# EAGLE design arm-board-rev2 (EAGLE 6.5.0)

## Sheet 1 of 6: Processor
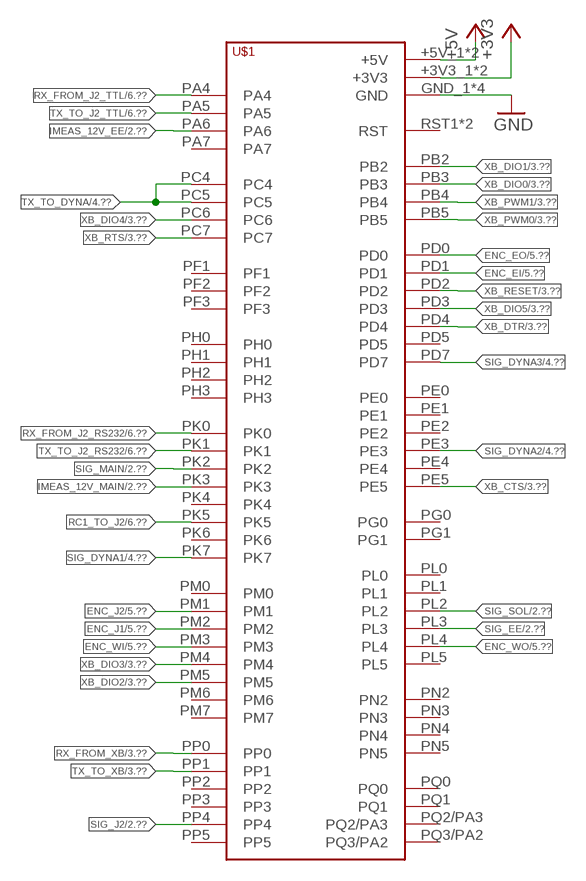
[diagram p0: schematic, sheet 1]

### Parts
U$1  TIVA-C-CONNECTED  [TIVA-C-CONNECTED]

### Nets
+3V3: U$1.+3V3_1(+3V3) U$1.+3V3_2(+3V3) ; also sheet 2,3,4,6
+5V: U$1.+5V_1(+5V) U$1.+5V_2(+5V) ; also sheet 2,5
ENC_EI: U$1.PD1 ; also sheet 5
ENC_EO: U$1.PD0 ; also sheet 5
ENC_J1: U$1.PM2 ; also sheet 5
ENC_J2: U$1.PM1 ; also sheet 5
ENC_WI: U$1.PM3 ; also sheet 5
ENC_WO: U$1.PL4 ; also sheet 5
GND: U$1.GND_1(GND) U$1.GND_2(GND) U$1.GND_3(GND) U$1.GND_4(GND) ; also sheet 2,3,4,5,6
IMEAS_12V_EE: U$1.PA6 ; also sheet 2
IMEAS_12V_MAIN: U$1.PK3 ; also sheet 2
RC1_TO_J2: U$1.PK5 ; also sheet 6
RX_FROM_J2_RS232: U$1.PK0 ; also sheet 6
RX_FROM_J2_TTL: U$1.PA4 ; also sheet 6
RX_FROM_XB: U$1.PP0 ; also sheet 3
SIG_DYNA1: U$1.PK7 ; also sheet 4
SIG_DYNA2: U$1.PE3 ; also sheet 4
SIG_DYNA3: U$1.PD7 ; also sheet 4
SIG_EE: U$1.PL3 ; also sheet 2
SIG_J2: U$1.PP4 ; also sheet 2
SIG_MAIN: U$1.PK2 ; also sheet 2
SIG_SOL: U$1.PL2 ; also sheet 2
TX_TO_DYNA: U$1.PC4 U$1.PC5 ; also sheet 4
TX_TO_J2_RS232: U$1.PK1 ; also sheet 6
TX_TO_J2_TTL: U$1.PA5 ; also sheet 6
TX_TO_XB: U$1.PP1 ; also sheet 3
XB_CTS: U$1.PE5 ; also sheet 3
XB_DIO0: U$1.PB3 ; also sheet 3
XB_DIO1: U$1.PB2 ; also sheet 3
XB_DIO2: U$1.PM5 ; also sheet 3
XB_DIO3: U$1.PM4 ; also sheet 3
XB_DIO4: U$1.PC6 ; also sheet 3
XB_DIO5: U$1.PD3 ; also sheet 3
XB_DTR: U$1.PD4 ; also sheet 3
XB_PWM0: U$1.PB5 ; also sheet 3
XB_PWM1: U$1.PB4 ; also sheet 3
XB_RESET: U$1.PD2 ; also sheet 3
XB_RTS: U$1.PC7 ; also sheet 3
Unconnected: U$1.PA7 U$1.PD5 U$1.PE0 U$1.PE1 U$1.PE2 U$1.PE4 U$1.PF1 U$1.PF2 U$1.PF3 U$1.PG0 U$1.PG1 U$1.PH0 U$1.PH1 U$1.PH2 U$1.PH3 U$1.PK4 U$1.PK6 U$1.PL0 U$1.PL1 U$1.PL5 U$1.PM0 U$1.PM6 U$1.PM7 U$1.PN2 U$1.PN3 U$1.PN4 U$1.PN5 U$1.PP2 U$1.PP3 U$1.PP5 U$1.PQ0 U$1.PQ1 U$1.PQ2/PA3 U$1.PQ3/PA2 U$1.RST1(RST) U$1.RST_2(RST)

## Sheet 2 of 6: Power
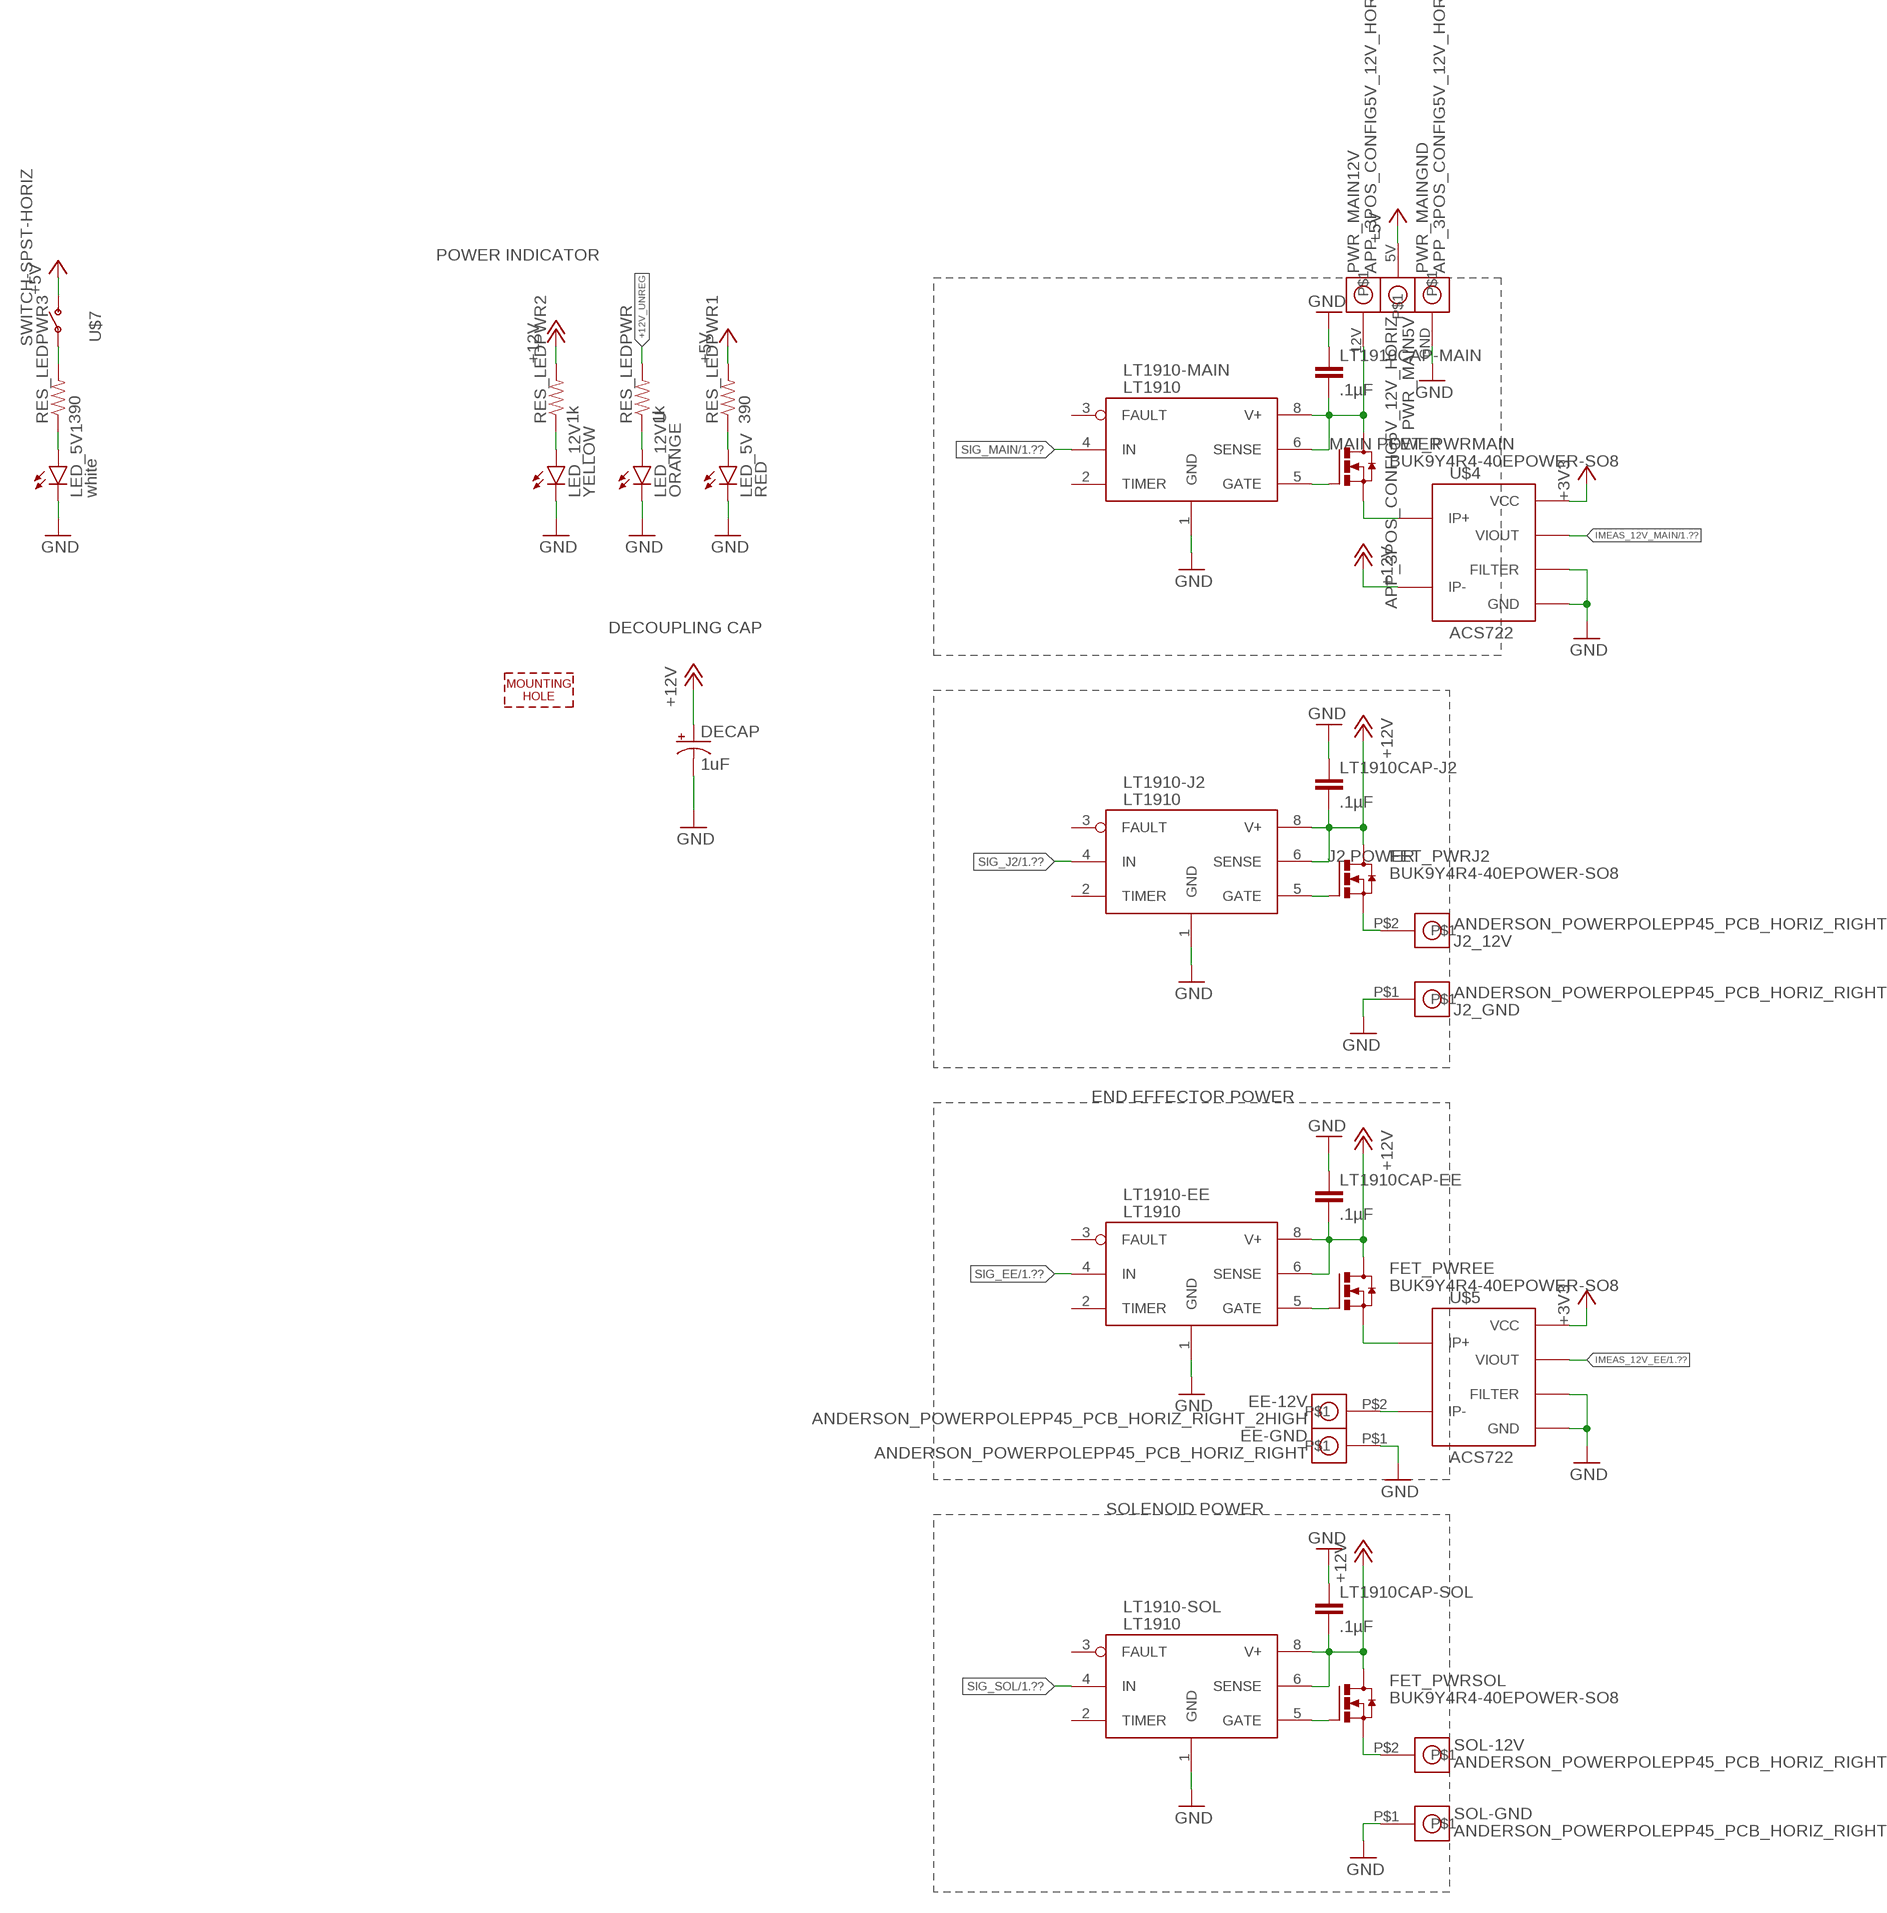
[diagram p1: schematic, sheet 2]

### Parts
DECAP  1uF  100UF-25V-20%(PTH)  [CPOL-RADIAL-100UF-25V]
EE-12V  ANDERSON_POWERPOLEPP45_PCB_HORIZ_RIGHT_2HIGH  [APP45_PCB_HORIZ_RIGHT_2HIGH]
EE-GND  ANDERSON_POWERPOLEPP45_PCB_HORIZ_RIGHT  [APP45_PCB_HORIZ_RIGHT]
FET_PWREE  BUK9Y4R4-40EPOWER-SO8  [POWER-SO8]
FET_PWRJ2  BUK9Y4R4-40EPOWER-SO8  [POWER-SO8]
FET_PWRMAIN  BUK9Y4R4-40EPOWER-SO8  [POWER-SO8]
FET_PWRSOL  BUK9Y4R4-40EPOWER-SO8  [POWER-SO8]
J2_12V  ANDERSON_POWERPOLEPP45_PCB_HORIZ_RIGHT_2HIGH  [APP45_PCB_HORIZ_RIGHT_2HIGH]
J2_GND  ANDERSON_POWERPOLEPP45_PCB_HORIZ_RIGHT  [APP45_PCB_HORIZ_RIGHT]
LED_5V  RED  LED0603  [LED-0603]
LED_5V1  white  LED1206  [LED-1206]
LED_12V  YELLOW  LED0603  [LED-0603]
LED_12VU  ORANGE  LED0603  [LED-0603]
LT1910-EE  LT1910  [SO8]
LT1910-J2  LT1910  [SO8]
LT1910-MAIN  LT1910  [SO8]
LT1910-SOL  LT1910  [SO8]
LT1910CAP-EE  .1µF  CAP0603-CAP  [0603-CAP]
LT1910CAP-J2  .1µF  CAP0603-CAP  [0603-CAP]
LT1910CAP-MAIN  .1µF  CAP0603-CAP  [0603-CAP]
LT1910CAP-SOL  .1µF  CAP0603-CAP  [0603-CAP]
PWR_MAIN  APP_3POS_CONFIG5V_12V_HORIZ  [APP45_5V_12V_HORIZ_CONFIG]
RES_LEDPWR  1k  RESISTOR0603  [0603-RES]
RES_LEDPWR1  390  RESISTOR0603  [0603-RES]
RES_LEDPWR2  1k  RESISTOR0603  [0603-RES]
RES_LEDPWR3  390  RESISTOR0603  [0603-RES]
SOL-12V  ANDERSON_POWERPOLEPP45_PCB_HORIZ_RIGHT_2HIGH  [APP45_PCB_HORIZ_RIGHT_2HIGH]
SOL-GND  ANDERSON_POWERPOLEPP45_PCB_HORIZ_RIGHT  [APP45_PCB_HORIZ_RIGHT]
U$3  MOUNTING_HOLE#6  [#6_SCREW]
U$4  ACS722  [SO-08]
U$5  ACS722  [SO-08]
U$7  SWITCH-SPST-HORIZ  [CW-GPTS203212BR2]

### Nets
+3V3: U$4.8(VCC) U$5.8(VCC) ; also sheet 1,3,4,6
+5V: PWR_MAIN.5V RES_LEDPWR1.2 U$7.P$2(S) ; also sheet 1,5
+12V: DECAP.1(+) FET_PWREE.5(D) FET_PWREE.6(D) FET_PWREE.7(D) FET_PWREE.8(D) FET_PWRJ2.5(D) FET_PWRJ2.6(D) FET_PWRJ2.7(D) FET_PWRJ2.8(D) FET_PWRSOL.5(D) FET_PWRSOL.6(D) FET_PWRSOL.7(D) FET_PWRSOL.8(D) LT1910-EE.6(SENSE) LT1910-EE.8(V+) LT1910-J2.6(SENSE) LT1910-J2.8(V+) LT1910-SOL.6(SENSE) LT1910-SOL.8(V+) LT1910CAP-EE.2 LT1910CAP-J2.2 LT1910CAP-SOL.2 RES_LEDPWR2.2 U$4.3(IP-) U$4.4(IP-) ; also sheet 4
+12V_UNREG: FET_PWRMAIN.5(D) FET_PWRMAIN.6(D) FET_PWRMAIN.7(D) FET_PWRMAIN.8(D) LT1910-MAIN.6(SENSE) LT1910-MAIN.8(V+) LT1910CAP-MAIN.2 PWR_MAIN.12V RES_LEDPWR.2
GATE-EE: FET_PWREE.4(G) LT1910-EE.5(GATE)
GATE-J2: FET_PWRJ2.4(G) LT1910-J2.5(GATE)
GATE-MAIN: FET_PWRMAIN.4(G) LT1910-MAIN.5(GATE)
GATE-SOL: FET_PWRSOL.4(G) LT1910-SOL.5(GATE)
GND: DECAP.2(-) EE-GND.P$1 J2_GND.P$1 LED_5V1.C LED_5V.C LED_12V.C LED_12VU.C LT1910-EE.1(GND) LT1910-J2.1(GND) LT1910-MAIN.1(GND) LT1910-SOL.1(GND) LT1910CAP-EE.1 LT1910CAP-J2.1 LT1910CAP-MAIN.1 LT1910CAP-SOL.1 PWR_MAIN.GND SOL-GND.P$1 U$4.5(GND) U$4.6(FILTER) U$5.5(GND) U$5.6(FILTER) ; also sheet 1,3,4,5,6
IMEAS_12V_EE: U$5.7(VIOUT) ; also sheet 1
IMEAS_12V_MAIN: U$4.7(VIOUT) ; also sheet 1
N$4: LED_12VU.A RES_LEDPWR.1
N$5: LED_5V.A RES_LEDPWR1.1
N$6: LED_12V.A RES_LEDPWR2.1
N$10: EE-12V.P$2 U$5.3(IP-) U$5.4(IP-)
N$11: LED_5V1.A RES_LEDPWR3.1
N$12: RES_LEDPWR3.2 U$7.P$1(P)
SIG_EE: LT1910-EE.4(IN) ; also sheet 1
SIG_J2: LT1910-J2.4(IN) ; also sheet 1
SIG_MAIN: LT1910-MAIN.4(IN) ; also sheet 1
SIG_SOL: LT1910-SOL.4(IN) ; also sheet 1
SOURCE-EE: FET_PWREE.1(S) FET_PWREE.2(S) FET_PWREE.3(S) U$5.1(IP+) U$5.2(IP+)
SOURCE-J2: FET_PWRJ2.1(S) FET_PWRJ2.2(S) FET_PWRJ2.3(S) J2_12V.P$2
SOURCE-MAIN: FET_PWRMAIN.1(S) FET_PWRMAIN.2(S) FET_PWRMAIN.3(S) U$4.1(IP+) U$4.2(IP+)
SOURCE-SOL: FET_PWRSOL.1(S) FET_PWRSOL.2(S) FET_PWRSOL.3(S) SOL-12V.P$2
Unconnected: LT1910-EE.2(TIMER) LT1910-EE.3(FAULT) LT1910-J2.2(TIMER) LT1910-J2.3(FAULT) LT1910-MAIN.2(TIMER) LT1910-MAIN.3(FAULT) LT1910-SOL.2(TIMER) LT1910-SOL.3(FAULT)

### Notes on the sheet
- POWER INDICATOR
- MAIN POWER
- DECOUPLING CAP
- J2 POWER
- END EFFECTOR POWER
- SOLENOID POWER

## Sheet 3 of 6: Xbee
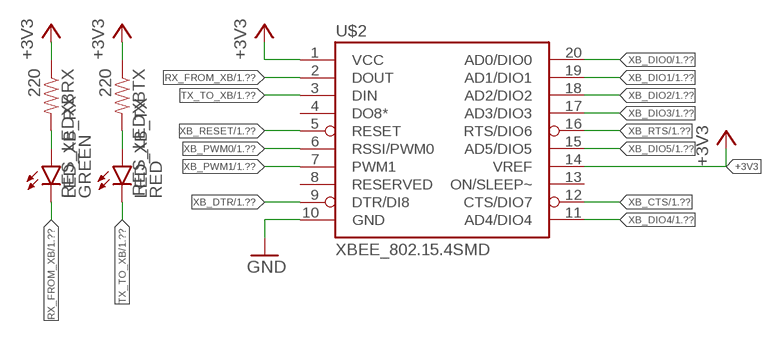
[diagram p2: schematic, sheet 3]

### Parts
LED_XB_RX  GREEN  LED0603  [LED-0603]
LED_XB_TX  RED  LED0603  [LED-0603]
RES_LEDXBRX  220  RESISTOR0603  [0603-RES]
RES_LEDXBTX  220  RESISTOR0603  [0603-RES]
U$2  XBEE_802.15.4SMD  [XBEE_802.15.4_SMD]

### Nets
+3V3: RES_LEDXBRX.1 RES_LEDXBTX.1 U$2.1(VCC) U$2.14(VREF) ; also sheet 1,2,4,6
GND: U$2.10(GND) ; also sheet 1,2,4,5,6
N$1: LED_XB_RX.A RES_LEDXBRX.2
N$2: LED_XB_TX.A RES_LEDXBTX.2
RX_FROM_XB: LED_XB_RX.C U$2.2(DOUT) ; also sheet 1
TX_TO_XB: LED_XB_TX.C U$2.3(DIN) ; also sheet 1
XB_CTS: U$2.12(CTS/DIO7) ; also sheet 1
XB_DIO0: U$2.20(AD0/DIO0) ; also sheet 1
XB_DIO1: U$2.19(AD1/DIO1) ; also sheet 1
XB_DIO2: U$2.18(AD2/DIO2) ; also sheet 1
XB_DIO3: U$2.17(AD3/DIO3) ; also sheet 1
XB_DIO4: U$2.11(AD4/DIO4) ; also sheet 1
XB_DIO5: U$2.15(AD5/DIO5) ; also sheet 1
XB_DTR: U$2.9(DTR/DI8) ; also sheet 1
XB_PWM0: U$2.6(RSSI/PWM0) ; also sheet 1
XB_PWM1: U$2.7(PWM1) ; also sheet 1
XB_RESET: U$2.5(RESET) ; also sheet 1
XB_RTS: U$2.16(RTS/DIO6) ; also sheet 1
Unconnected: U$2.4(DO8*) U$2.8(RESERVED) U$2.13(ON/SLEEP~)

## Sheet 4 of 6: Dynamixels
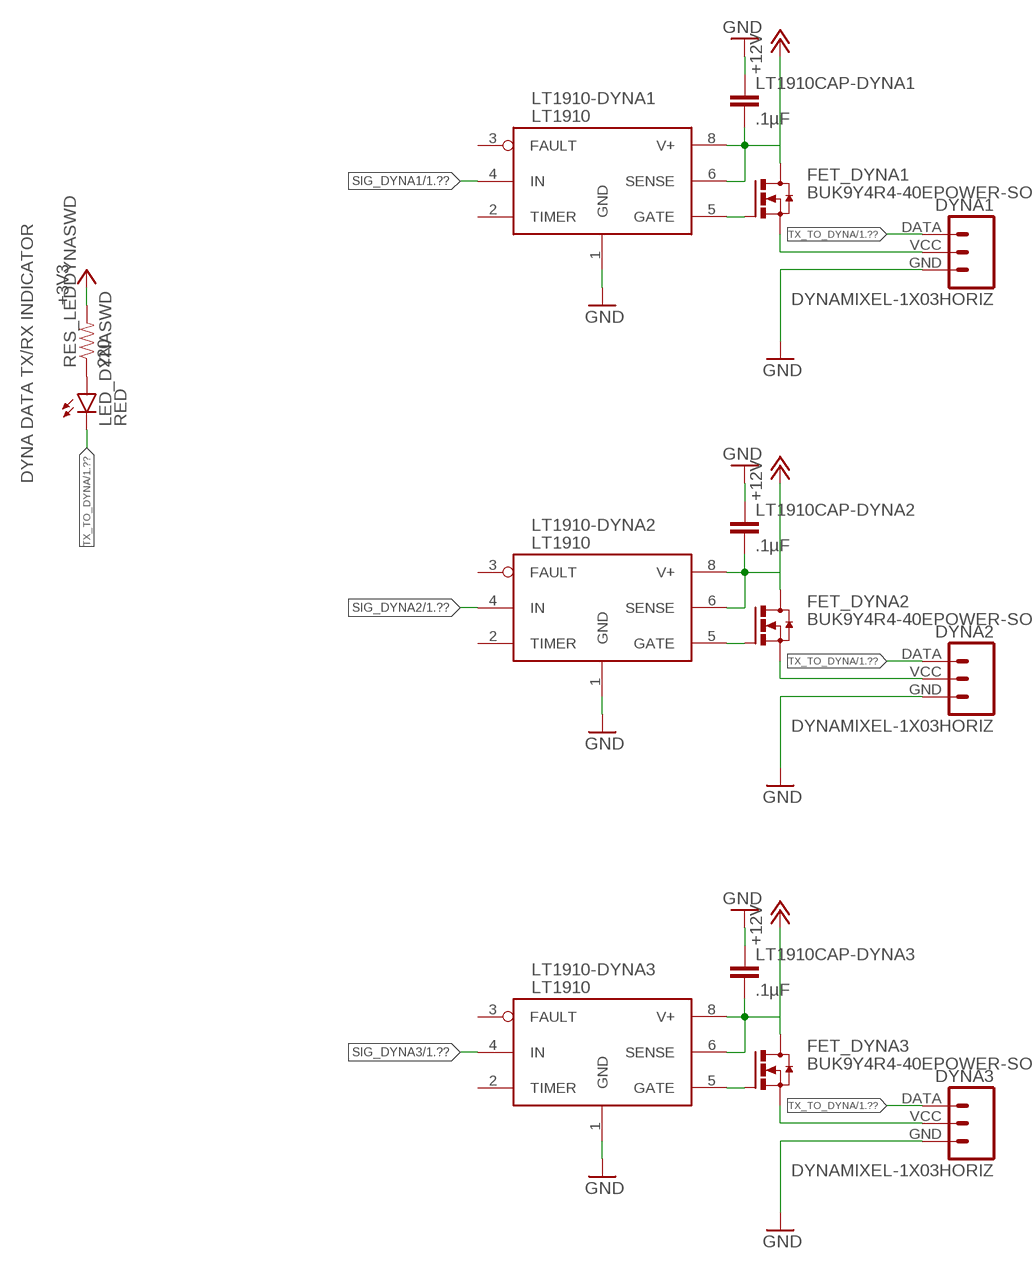
[diagram p3: schematic, sheet 4]

### Parts
DYNA1  DYNAMIXEL-1X03HORIZ  [MLX-SPOX5268-3PIN]
DYNA2  DYNAMIXEL-1X03HORIZ  [MLX-SPOX5268-3PIN]
DYNA3  DYNAMIXEL-1X03HORIZ  [MLX-SPOX5268-3PIN]
FET_DYNA1  BUK9Y4R4-40EPOWER-SO8  [POWER-SO8]
FET_DYNA2  BUK9Y4R4-40EPOWER-SO8  [POWER-SO8]
FET_DYNA3  BUK9Y4R4-40EPOWER-SO8  [POWER-SO8]
LED_DYNASWD  RED  LED0603  [LED-0603]
LT1910-DYNA1  LT1910  [SO8]
LT1910-DYNA2  LT1910  [SO8]
LT1910-DYNA3  LT1910  [SO8]
LT1910CAP-DYNA1  .1µF  CAP0603-CAP  [0603-CAP]
LT1910CAP-DYNA2  .1µF  CAP0603-CAP  [0603-CAP]
LT1910CAP-DYNA3  .1µF  CAP0603-CAP  [0603-CAP]
RES_LEDDYNASWD  220  RESISTOR0603  [0603-RES]

### Nets
+3V3: RES_LEDDYNASWD.2 ; also sheet 1,2,3,6
+12V: FET_DYNA1.5(D) FET_DYNA1.6(D) FET_DYNA1.7(D) FET_DYNA1.8(D) FET_DYNA2.5(D) FET_DYNA2.6(D) FET_DYNA2.7(D) FET_DYNA2.8(D) FET_DYNA3.5(D) FET_DYNA3.6(D) FET_DYNA3.7(D) FET_DYNA3.8(D) LT1910-DYNA1.6(SENSE) LT1910-DYNA1.8(V+) LT1910-DYNA2.6(SENSE) LT1910-DYNA2.8(V+) LT1910-DYNA3.6(SENSE) LT1910-DYNA3.8(V+) LT1910CAP-DYNA1.2 LT1910CAP-DYNA2.2 LT1910CAP-DYNA3.2 ; also sheet 2
GATE-DYNA1: FET_DYNA1.4(G) LT1910-DYNA1.5(GATE)
GATE-DYNA2: FET_DYNA2.4(G) LT1910-DYNA2.5(GATE)
GATE-DYNA3: FET_DYNA3.4(G) LT1910-DYNA3.5(GATE)
GND: DYNA1.GND DYNA2.GND DYNA3.GND LT1910-DYNA1.1(GND) LT1910-DYNA2.1(GND) LT1910-DYNA3.1(GND) LT1910CAP-DYNA1.1 LT1910CAP-DYNA2.1 LT1910CAP-DYNA3.1 ; also sheet 1,2,3,5,6
N$3: LED_DYNASWD.A RES_LEDDYNASWD.1
SIG_DYNA1: LT1910-DYNA1.4(IN) ; also sheet 1
SIG_DYNA2: LT1910-DYNA2.4(IN) ; also sheet 1
SIG_DYNA3: LT1910-DYNA3.4(IN) ; also sheet 1
SOURCE-DYNA1: DYNA1.VCC FET_DYNA1.1(S) FET_DYNA1.2(S) FET_DYNA1.3(S)
SOURCE-DYNA2: DYNA2.VCC FET_DYNA2.1(S) FET_DYNA2.2(S) FET_DYNA2.3(S)
SOURCE-DYNA3: DYNA3.VCC FET_DYNA3.1(S) FET_DYNA3.2(S) FET_DYNA3.3(S)
TX_TO_DYNA: DYNA1.DATA DYNA2.DATA DYNA3.DATA LED_DYNASWD.C ; also sheet 1
Unconnected: LT1910-DYNA1.2(TIMER) LT1910-DYNA1.3(FAULT) LT1910-DYNA2.2(TIMER) LT1910-DYNA2.3(FAULT) LT1910-DYNA3.2(TIMER) LT1910-DYNA3.3(FAULT)

### Notes on the sheet
- DYNA DATA TX/RX INDICATOR

## Sheet 5 of 6: Encoders
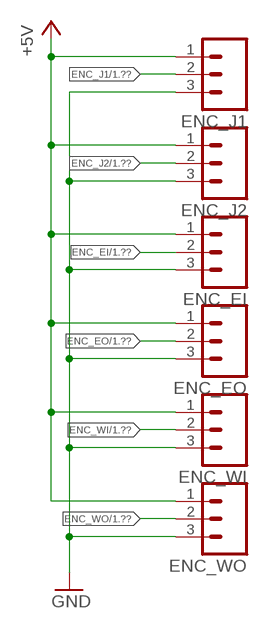
[diagram p4: schematic, sheet 5]

### Parts
ENC_EI  M03  [MOLEX_0436500300]
ENC_EO  M03  [MOLEX_0436500300]
ENC_J1  M03  [MOLEX_0436500300]
ENC_J2  M03  [MOLEX_0436500300]
ENC_WI  M03  [MOLEX_0436500300]
ENC_WO  M03  [MOLEX_0436500300]

### Nets
+5V: ENC_EI.1 ENC_EO.1 ENC_J1.1 ENC_J2.1 ENC_WI.1 ENC_WO.1 ; also sheet 1,2
ENC_EI: ENC_EI.2 ; also sheet 1
ENC_EO: ENC_EO.2 ; also sheet 1
ENC_J1: ENC_J1.2 ; also sheet 1
ENC_J2: ENC_J2.2 ; also sheet 1
ENC_WI: ENC_WI.2 ; also sheet 1
ENC_WO: ENC_WO.2 ; also sheet 1
GND: ENC_EI.3 ENC_EO.3 ENC_J1.3 ENC_J2.3 ENC_WI.3 ENC_WO.3 ; also sheet 1,2,3,4,6

## Sheet 6 of 6: J2
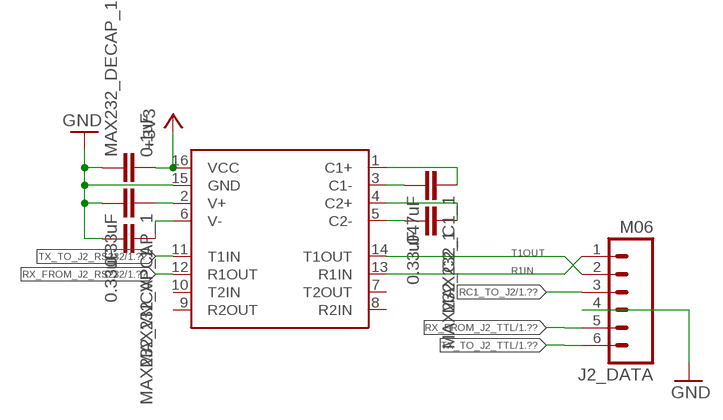
[diagram p5: schematic, sheet 6]

### Parts
J2_DATA  M06  [MOLEX_0436500600]
MAX232_1  MAX3232SO16  [SO16]
MAX232_C1_1  .047uF  CAP0603-CAP  [0603-CAP]
MAX232_C2_1  0.33uF  CAP0603-CAP  [0603-CAP]
MAX232_DECAP_1  0.1uF  CAP0603-CAP  [0603-CAP]
MAX232_VNCAP_1  0.33uF  CAP0603-CAP  [0603-CAP]
MAX232_VPCAP_1  0.33uF  CAP0603-CAP  [0603-CAP]

### Nets
+3V3: MAX232_1.16(VCC) MAX232_DECAP_1.2 ; also sheet 1,2,3,4
GND: J2_DATA.4 MAX232_1.15(GND) MAX232_DECAP_1.1 MAX232_VNCAP_1.2 MAX232_VPCAP_1.2 ; also sheet 1,2,3,4,5
N$1_1: MAX232_1.1(C1+) MAX232_C1_1.1
N$2_1: MAX232_1.2(V+) MAX232_VPCAP_1.1
N$3_1: MAX232_1.3(C1-) MAX232_C1_1.2
N$4_1: MAX232_1.4(C2+) MAX232_C2_1.1
N$5_1: MAX232_1.5(C2-) MAX232_C2_1.2
N$6_1: MAX232_1.6(V-) MAX232_VNCAP_1.1
R1IN: J2_DATA.1 MAX232_1.13(R1IN)
RC1_TO_J2: J2_DATA.3 ; also sheet 1
RX_FROM_J2_RS232: MAX232_1.12(R1OUT) ; also sheet 1
RX_FROM_J2_TTL: J2_DATA.5 ; also sheet 1
T1OUT: J2_DATA.2 MAX232_1.14(T1OUT)
TX_TO_J2_RS232: MAX232_1.11(T1IN) ; also sheet 1
TX_TO_J2_TTL: J2_DATA.6 ; also sheet 1
Unconnected: MAX232_1.7(T2OUT) MAX232_1.8(R2IN) MAX232_1.9(R2OUT) MAX232_1.10(T2IN)

## Library data of the parts
DECAP = SparkFun-Capacitors:100UF-25V-20%(PTH): CAP-08439; PROD_ID: CAP-08439
DYNA1-DYNA3 = MRDT-2015-Arm:DYNAMIXEL-1X03; MFR: Molex; MFR_PN: 0022057035; ORIENT: Horiz
EE-12V EE-GND J2_12V J2_GND SOL-12V SOL-GND = MRDT-Connectors:ANDERSON_POWERPOLE: http://www.powerwerx.com/anderson-powerpoles/
ENC_EI ENC_EO ENC_J1 ENC_J2 ENC_WI ENC_WO = MRDT-Connectors:M03
FET_DYNA1-FET_DYNA3 FET_PWREE FET_PWRJ2 FET_PWRMAIN FET_PWRSOL = MRDT-2015-General:BUK9Y4R4-40E; MFR: NXP; MFR_PN: BUK9Y4R4-40E; PACKAGE: POWER-SO8
J2_DATA = MRDT-Connectors:M06
LED_5V LED_5V1 LED_12V LED_12VU LED_DYNASWD LED_XB_RX LED_XB_TX = SparkFun-LED:LED: LEDs Standard schematic elements and footprints for 5mm, 3mm, 1206, and 0603 sized LEDs. 5mm - Spark Fun Electronics SKU : COM-00529 (and others)
LT1910-DYNA1-LT1910-DYNA3 LT1910-EE LT1910-J2 LT1910-MAIN LT1910-SOL = Jake:LT1910
LT1910CAP-DYNA1-LT1910CAP-DYNA3 LT1910CAP-EE LT1910CAP-J2 LT1910CAP-MAIN LT1910CAP-SOL MAX232_C1_1 MAX232_C2_1 MAX232_DECAP_1 MAX232_VNCAP_1 MAX232_VPCAP_1 = SparkFun-Capacitors:CAP: Capacitor Standard 0603 ceramic capacitor, and 0.1" leaded capacitor.
MAX232_1 = MRDT-Digital-ICs:MAX3232: MAX3232 RS232 Transceiver http://pdfserv.maximintegrated.com/en/ds/MAX3222-MAX3241.pdf
PWR_MAIN = MRDT-Connectors:APP_3POS_CONFIG; COLOR1: YELLOW; COLOR2: RED; COLOR3: BLACK
RES_LEDDYNASWD RES_LEDPWR RES_LEDPWR1-RES_LEDPWR3 RES_LEDXBRX RES_LEDXBTX = SparkFun-Resistors:RESISTOR: Resistor Basic schematic elements and footprints for 0603, 1206, and PTH resistors.
U$1 = MRDT-2015-General:TIVA-C-CONNECTED: TIVA C CONNECTED LAUNCHPAD
U$2 = MRDT-RF:XBEE_802.15.4
U$3 = MRDT-Hardware:MOUNTING_HOLE: Mounting hole for M6 bolt. Standard use mounting hole for: Tiva C Connected - M6 Anderson Powerpole Mounting Wing - M8 Most frame-mounted PCB's - M8
U$4 U$5 = MRDT-PowerICs:ACS722
U$7 = MRDT-Electromechanical:SWITCH-SPST-HORIZ

## Board
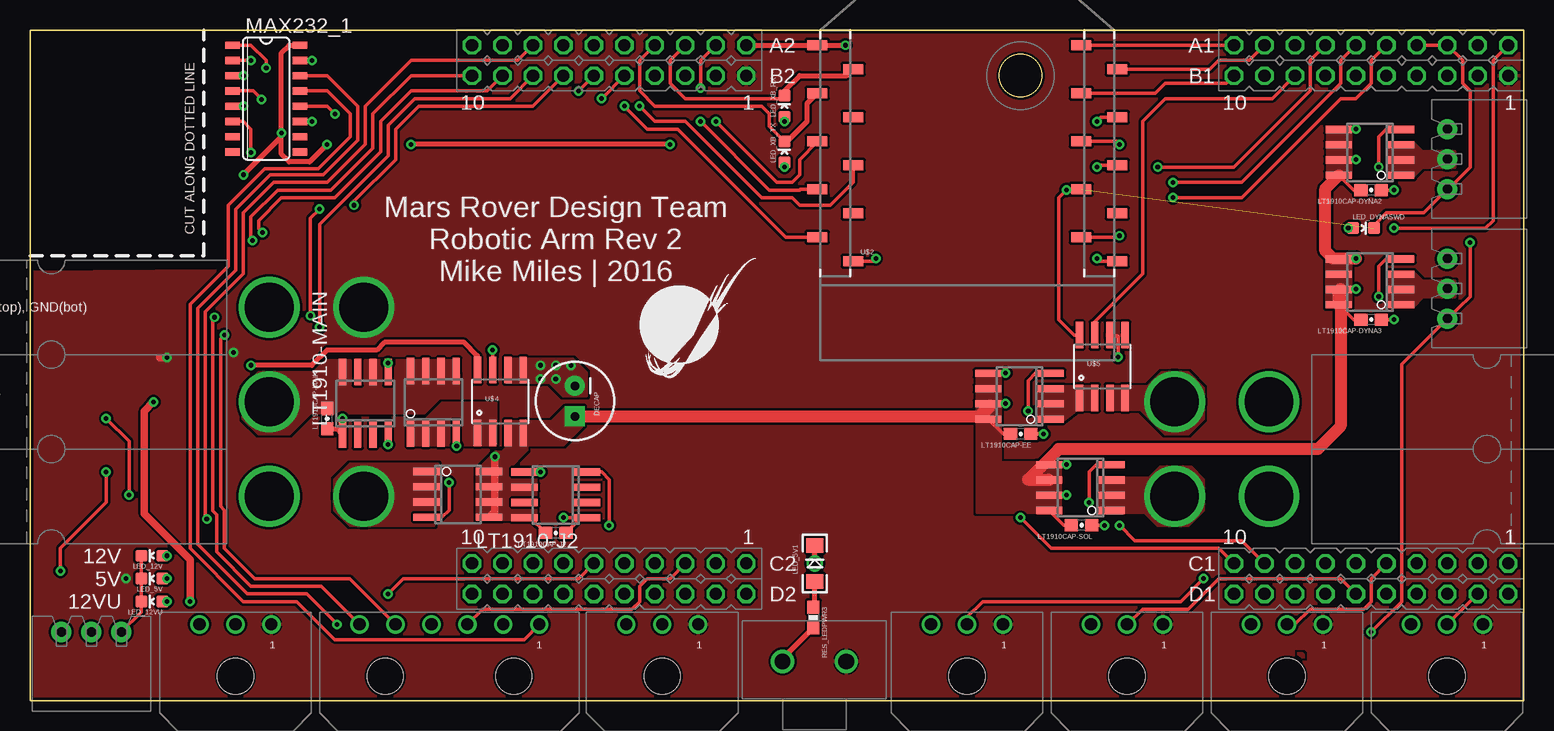
[diagram p6: board, top side]
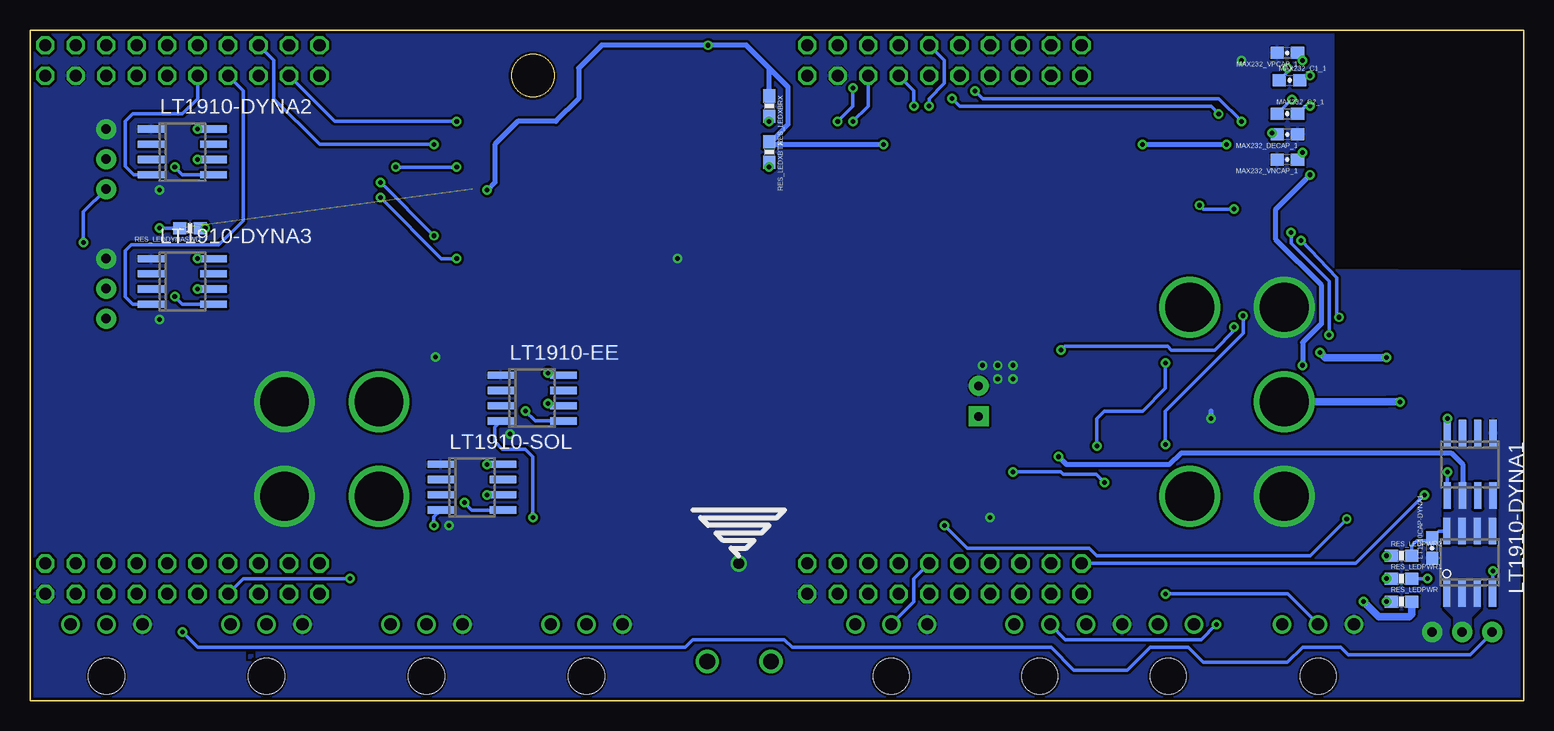
[diagram p7: board, bottom side, seen from below]

Size 124.46 x 55.88 mm. Coordinates in mm from the lower left corner, seen from the top.
Outline: 124.46,55.88 124.46,0 0,0 0,55.88 124.46,55.88
Copper layers (1*16): Top 0.035mm / dielectric 1.5mm / Bottom 0.035mm
Design rules "default *": minimum track width 10mil, minimum drill 15mil, track to track 8mil, track to pad 8mil, pad to pad 8mil, via to via 8mil, smd to smd 8mil, copper to edge 8mil, drill to drill 8mil, minimum pad ring 10mil, minimum via ring 8mil, stop-mask expansion 4mil, vias tented up to drill 0mil, thermal gap 5mil
tKeepout: area 0,35.9 to 15.6,56
bKeepout: area 0,35.9 to 15.6,56
tRestrict: area 0,35.9 to 15.6,56
bRestrict: area 0,35.9 to 15.6,56
vRestrict: area 0,35.9 to 15.6,56

### Footprints (pad centres in the part's own frame; a part is rotated, then mirrored left to right if it is on the bottom)
CPOL-RADIAL-100UF-25V = drill 0.7 pad 1.651 square: 1 1.27,0 | drill 0.7 pad 1.651: 2 -1.27,0
MLX-SPOX5268-3PIN = drill 0.8 pad 1.676: DATA 5,0; GND 0,0; VCC 2.5,0
APP45_PCB_HORIZ_RIGHT_2HIGH = drill 4.064: P$2 36.068,3.937
APP45_PCB_HORIZ_RIGHT = drill 4.064: P$1 28.194,3.937
MOLEX_0436500300 = drill 1.016: 1 9.322,8.89; 2 6.325,8.89; 3 3.327,8.89 | hole 2.997: 6.325,4.572
POWER-SO8 = smd 0.6 x 2.2: 1 0.595,-0.6; 2 1.865,-0.6; 3 3.135,-0.6; 4 4.405,-0.6; 5 4.405,4.6; 6 3.135,4.6; 7 1.865,4.6; 8 0.595,4.6
MOLEX_0436500600 = drill 1.016: 1 18.313,8.89; 2 15.316,8.89; 3 12.319,8.89; 4 9.322,8.89; 5 6.325,8.89; 6 3.327,8.89 | hole 2.997: 5.486,4.572; 16.18,4.572
LED-0603 = smd 1 x 1: A 0,-0.877; C 0,0.877
LED-1206 = smd 1.2 x 1.4: A -1.5,0; C 1.5,0
SO8 = smd 0.6 x 2.2: 1 -1.905,-2.6; 2 -0.635,-2.6; 3 0.635,-2.6; 4 1.905,-2.6; 5 1.905,2.6; 6 0.635,2.6; 7 -0.635,2.6; 8 -1.905,2.6
0603-CAP = smd 1.1 x 1: 1 -0.85,0; 2 0.85,0
SO16 = smd 0.6 x 1.2: 1 -4.445,-2.8; 2 -3.175,-2.8; 3 -1.905,-2.8; 4 -0.635,-2.8; 5 0.635,-2.8; 6 1.905,-2.8; 7 3.175,-2.8; 8 4.445,-2.8; 9 4.445,2.8; 10 3.175,2.8; 11 1.905,2.8; 12 0.635,2.8; 13 -0.635,2.8; 14 -1.905,2.8; 15 -3.175,2.8; 16 -4.445,2.8
APP45_5V_12V_HORIZ_CONFIG = drill 4.064: 5V 36.068,11.811; 12V 28.194,3.937; GND 28.194,11.811
0603-RES = smd 1.1 x 1: 1 -0.85,0; 2 0.85,0
TIVA-C-CONNECTED = drill 1.016 octagon: +3V3_1 59.69,54.61; +3V3_2 123.19,54.61; +5V_1 59.69,52.07; +5V_2 123.19,52.07; GND_1 57.15,52.07; GND_2 59.69,8.89; GND_3 120.65,52.07; GND_4 123.19,8.89; PA4 39.37,52.07; PA5 36.83,52.07; PA6 105.41,52.07; PA7 52.07,8.89; PB2 102.87,54.61; PB3 100.33,54.61; PB4 54.61,52.07; PB5 52.07,52.07; PC4 118.11,54.61; PC5 115.57,54.61; PC6 113.03,54.61; PC7 105.41,54.61; PD0 107.95,8.89; PD1 110.49,8.89; PD2 57.15,54.61; PD3 107.95,54.61; PD4 49.53,54.61; PD5 46.99,54.61; PD7 107.95,52.07; PE0 118.11,52.07; PE1 115.57,52.07; PE2 113.03,52.07; PE3 110.49,52.07; PE4 120.65,54.61; PE5 110.49,54.61; PF1 123.19,11.43; PF2 120.65,11.43; PF3 118.11,11.43; PG0 115.57,11.43; PG1 59.69,11.43; PH0 44.45,11.43; PH1 41.91,11.43; PH2 118.11,8.89; PH3 115.57,8.89; PK0 49.53,52.07; PK1 46.99,52.07; PK2 44.45,52.07; PK3 41.91,52.07; PK4 57.15,11.43; PK5 54.61,11.43; PK6 39.37,11.43; PK7 36.83,11.43; PL0 107.95,11.43; PL1 105.41,11.43; PL2 102.87,11.43; PL3 100.33,11.43; PL4 113.03,11.43; PL5 110.49,11.43; PM0 52.07,11.43; PM1 49.53,11.43; PM2 46.99,11.43; PM3 120.65,8.89; PM4 102.87,52.07; PM5 100.33,52.07; PM6 36.83,8.89; PM7 57.15,8.89; PN2 105.41,8.89; PN3 102.87,8.89; PN4 36.83,54.61; PN5 39.37,54.61; PP0 54.61,54.61; PP1 52.07,54.61; PP2 100.33,8.89; PP3 41.91,8.89; PP4 41.91,54.61; PP5 54.61,8.89; PQ0 44.45,54.61; PQ1 39.37,8.89; PQ2/PA3 46.99,8.89; PQ3/PA2 44.45,8.89; RST1 49.53,8.89; RST_2 113.03,8.89
XBEE_802.15.4_SMD = smd 1.7 x 0.85: 1 -13.77,20; 2 -10.77,18; 3 -13.77,16; 4 -10.77,14; 5 -13.77,12; 6 -10.77,10; 7 -13.77,8; 8 -10.77,6; 9 -13.77,4; 10 -10.77,2; 11 11.23,2; 12 8.23,4; 13 11.23,6; 14 8.23,8; 15 11.23,10; 16 8.23,12; 17 11.23,14; 18 8.23,16; 19 11.23,18; 20 8.23,20
SO-08 = smd 0.61 x 2.21: 1 0.457,-0.813; 2 1.727,-0.813; 3 2.997,-0.813; 4 4.267,-0.813; 5 4.267,4.419; 6 2.997,4.419; 7 1.727,4.419; 8 0.457,4.419
CW-GPTS203212BR2 = drill 1.3: P$1 3.4,3.35; P$2 3.4,8.65

### Placement (x,y rotation side)
DECAP  45.4,24.96 270 top
DYNA1  7.62,5.71 180 top
DYNA2  118.11,47.62 270 top
DYNA3  118.11,36.83 270 top
EE-12V  131.44,28.83 180 top
EE-GND  131.44,28.83 180 top
ENC_EI  85.09,-2.54 0 top
ENC_EO  71.75,-2.54 0 top
ENC_J1  10.79,-2.54 0 top
ENC_J2  46.35,-2.54 0 top
ENC_WI  111.76,-2.54 0 top
ENC_WO  98.42,-2.54 0 top
FET_DYNA1  6.99,9.53 0 bottom
FET_DYNA2  113.67,43.18 90 top
FET_DYNA3  113.67,32.38 90 top
FET_PWREE  84.45,22.86 90 top
FET_PWRJ2  33.66,19.69 270 top
FET_PWRMAIN  31.11,22.86 0 top
FET_PWRSOL  89.53,15.24 90 top
J2_12V  -8.26,13.08 0 top
J2_DATA  24.13,-2.54 0 top
J2_GND  -8.26,13.08 0 top
LED_5V  10.16,10.16 90 top
LED_5V1  65.41,11.43 90 top
LED_12V  10.16,12.07 90 top
LED_12VU  10.16,8.25 90 top
LED_DYNASWD  111.12,39.37 270 top
LED_XB_RX  62.87,49.53 0 top
LED_XB_TX  62.87,45.72 0 top
LT1910-DYNA1  4.45,19.69 180 bottom
LT1910-DYNA2  111.76,45.72 270 bottom
LT1910-DYNA3  111.76,34.92 270 bottom
LT1910-EE  82.61,25.21 270 bottom
LT1910-J2  43.81,17.14 90 top
LT1910-MAIN  27.94,24.77 0 top
LT1910-SOL  87.63,17.78 270 bottom
LT1910CAP-DYNA1  7.62,12.7 90 bottom
LT1910CAP-DYNA2  111.76,42.55 180 top
LT1910CAP-DYNA3  111.76,31.75 180 top
LT1910CAP-EE  82.55,22.23 180 top
LT1910CAP-J2  43.81,13.97 180 top
LT1910CAP-MAIN  24.77,23.49 90 top
LT1910CAP-SOL  87.63,14.61 180 top
MAX232_1  19.68,50.16 270 top
MAX232_C1_1  19.49,51.69 0 bottom
MAX232_C2_1  19.68,48.89 0 bottom
MAX232_DECAP_1  19.68,47.18 180 bottom
MAX232_VNCAP_1  19.68,45.09 180 bottom
MAX232_VPCAP_1  19.68,53.98 180 bottom
PWR_MAIN  -8.26,20.95 0 top
RES_LEDDYNASWD  111.12,39.37 180 bottom
RES_LEDPWR  10.16,8.25 0 bottom
RES_LEDPWR1  10.16,10.16 0 bottom
RES_LEDPWR2  10.16,12.07 0 bottom
RES_LEDPWR3  65.28,6.92 270 top
RES_LEDXBRX  62.87,49.53 270 bottom
RES_LEDXBTX  62.87,45.72 270 bottom
SOL-12V  131.44,20.95 180 top
SOL-GND  131.44,20.95 180 top
U$1  0,0 0 top
U$2  79.38,34.61 0 top
U$3  82.55,52.07 0 top
U$4  36.83,23.11 0 top
U$5  87,26.03 0 top
U$6  [MRDT_LOGO]  50.8,26.03 0 top
U$7  59.37,6.67 270 top

### Tracks (layer width: path | path; a pad name or v marks a point on that pad's centre or on a via)
+3V3  (via drill 0.38)  (1 unrouted)
  Top 0.305: U$2.1 | U$1.+3V3_2 121.92,53.34 121.92,40 121.28,39.37 v113.67,39.37 | U$5.8 87.02,30.45 85.72,31.75 85.72,41.91 v86.36,42.55
  Top 0.406: U$1.+3V3_1 U$2.1 | U$2.1 v67.94,54.61 | v86.36,42.55 87.54,42.55 U$2.14 | U$4.8 37.29,28.75 36.2,29.84 29.53,29.84 28.89,29.21 24.77,29.21 23.5,27.94 v18.41,27.94 | v17.78,43.81 20.95,46.99 v20.95,47.31 | v20.95,47.31 20.95,53.98 21.59,54.61 MAX232_1.16 | v53.34,46.35 v31.75,46.35 | v24.77,46.35 23.3,44.89 21.59,44.89 20.95,45.53 v20.95,47.31
  Bottom 0.305: 62.65,46.35 RES_LEDXBTX.1 | 62.65,50.38 RES_LEDXBRX.1 62.87,50.16 | v113.67,39.37 RES_LEDDYNASWD.2
  Bottom 0.406: v86.36,42.55 85.72,43.18 85.72,46.35 83.82,48.26 80.64,48.26 78.74,50.16 78.74,52.7 76.83,54.61 v67.94,54.61 64.77,54.61 62.87,52.7 | RES_LEDXBRX.1 62.87,52.7 | RES_LEDXBTX.1 62.65,46.57 | 62.65,46.57 61.28,48.01 61.28,51.12 62.87,52.7 | v17.78,43.81 20.64,40.96 20.64,38.42 16.83,34.61 16.83,31.43 18.41,29.84 v18.41,27.94 | v20.95,47.31 MAX232_DECAP_1.2 | 62.65,46.57 62.87,46.35 v53.34,46.35 | v31.75,46.35 v24.77,46.35
+5V  (via drill 0.38)
  Top 0.61: v11.43,28.58 10.79,28.58
  Bottom 0.305: RES_LEDPWR1.2 v8,10.16
  Bottom 0.61: v16.95,29.02 16.51,28.58 v11.43,28.58
  pour Top (rank 6): -3.17,-3.81 130.81,-3.81 130.81,60.32 -3.17,60.32
+12V  (via drill 0.38)
  Top 0.305: FET_DYNA2.7 110.45,45.05 v110.49,45.09 | v110.49,47.62 109.11,47.62 FET_DYNA2.5 | LT1910CAP-DYNA2.2 110.3,42.55 FET_DYNA2.8 | v110.49,34.29 109.22,34.29 109.11,34.29 FET_DYNA3.7 | v110.49,36.83 109.11,36.83 FET_DYNA3.5 | LT1910CAP-DYNA3.2 110.3,31.75 FET_DYNA3.8 | v81.28,24.77 79.89,24.77 FET_PWREE.7 | v81.28,27.3 79.89,27.3 FET_PWREE.5 | LT1910CAP-EE.2 81.08,22.23 FET_PWREE.8 | v86.36,19.69 84.97,19.69 FET_PWRSOL.5 | v86.36,17.14 84.97,17.14 FET_PWRSOL.7 | LT1910CAP-SOL.2 86.17,14.61 FET_PWRSOL.8 | LT1910-J2.8 41.7,15.24 LT1910CAP-J2.2
  Top 0.61: FET_PWRJ2.5 38.73,15.76 v38.73,20.32
  Top 1.016: FET_DYNA3.8 109.06,34.13 109.22,34.29 109.22,22.86 107.31,20.95 85.72,20.95 83.19,18.41 84.89,18.41 FET_PWRSOL.6 | v110.49,36.83 108.58,36.83 107.95,37.46 107.95,42.66 FET_DYNA2.8 | DECAP.1 79.12,23.69 LT1910-EE.6
  Bottom 0.305: FET_DYNA1.8 7.04,14.12 LT1910CAP-DYNA1.2 7.83,13.34 8.89,13.34 9.31,12.91 RES_LEDPWR2.2 | v110.49,45.09 LT1910-DYNA2.6 | LT1910-DYNA2.8 v110.49,47.62 | LT1910-DYNA3.6 v110.49,34.29 | LT1910-DYNA3.8 v110.49,36.83 | LT1910-EE.6 81.09,24.57 v81.28,24.77 | LT1910-EE.8 81.09,27.12 v81.28,27.3 | LT1910-SOL.8 v86.36,19.69 | LT1910-SOL.6 v86.36,17.14
  Bottom 0.406: v38.73,20.32 38.1,19.69 29.53,19.69 28.51,20.64 6.03,20.64 5.08,19.69 LT1910-DYNA1.6
  pour Bottom (isolate 0.254, no thermals): 2.41,18.03 2.41,13.21 6.54,13.21 6.54,18.03
  pour Top (no thermals): 108.14,47.75 108.14,43.62 110.05,43.62 110.05,47.75
  pour Top (no thermals): 108.08,36.96 108.08,32.83 110.05,32.83 110.05,36.96
  pour Top (no thermals): 78.93,27.43 78.93,23.3 80.84,23.3 80.84,27.43
  pour Top (no thermals): 84.01,19.81 84.01,15.68 85.85,15.68 85.85,19.81
  pour Top (no thermals): 80.84,23.37 80.84,19.81 84.01,19.81 85.85,19.81 85.85,15.68 78.93,15.68 78.93,25.02 78.93,27.43 80.84,27.43
  pour Top (no thermals): 37.27,19.24 37.27,15.11 42.16,15.11 42.16,19.24
  pour Top (no thermals): 39.69,23.24 43.5,23.24 44.64,24.38 46.1,24.38 46.1,22.99 44.45,21.34 39.69,21.34
  pour Top (no thermals): 37.34,19.24 38.8,20.7 39.37,20.7 39.69,21.02 39.69,23.24 41.4,23.24 41.4,20.89 39.75,19.24
+12V_UNREG  (via drill 0.38)
  Top 0.61: v13.34,8.25 13.34,11.75 9.53,15.56 9.53,24.13 v10.29,24.89
  Bottom 0.61: PWR_MAIN.12V 11.43,24.89 v10.29,24.89 | RES_LEDPWR.2 9.31,7.2 9.53,6.99 12.06,6.99 v13.34,8.25
  pour Top (rank 5, no thermals): 23.56,27.3 19.05,27.3 17.78,26.03 17.78,23.49 19.05,22.23 21.59,22.23 23.37,24 35.75,24 35.69,28.32 24.57,28.32
ENC_EI
  Top 0.305: ENC_EI.2 91.44,6.35 92.71,7.62 96.52,7.62 99.06,10.16 109.22,10.16 U$1.PD1
ENC_EO  (via drill 0.38)
  Top 0.305: ENC_EO.2 78.08,6.96 79.38,8.25 95.89,8.25 v97.79,10.16
  Bottom 0.305: v97.79,10.16 106.68,10.16 U$1.PD0
ENC_J1  (via drill 0.38)
  Top 0.305: v29.84,8.89 31.11,10.16 45.72,10.16 U$1.PM2
  Bottom 0.305: ENC_J1.2 19.66,8.89 v29.84,8.89
ENC_J2
  Bottom 0.305: ENC_J2.2 52.68,6.38 50.8,8.25 50.8,10.16 U$1.PM1
ENC_WI
  Top 0.305: ENC_WI.2 118.11,6.35 U$1.PM3
ENC_WO
  Top 0.305: ENC_WO.2 105.41,6.35 106.68,7.62 111.12,7.62 111.76,8.25 111.76,10.16 U$1.PL4
GATE-DYNA1  (via drill 0.38)
  Top 0.305: v2.54,10.79 2.54,12.7 6.35,16.51 v6.35,19.05
  Bottom 0.305: FET_DYNA1.4 2.58,10.75 v2.54,10.79 | v6.35,19.05 LT1910-DYNA1.5
GATE-DYNA2  (via drill 0.38)
  Top 0.305: v112.39,44.45 112.39,46.99 113.03,47.62 114.22,47.62 FET_DYNA2.4
  Bottom 0.305: LT1910-DYNA2.5 111.76,43.81 v112.39,44.45
GATE-DYNA3  (via drill 0.38)
  Top 0.305: v112.39,33.66 112.39,36.2 113.03,36.83 114.22,36.83 FET_DYNA3.4
  Bottom 0.305: LT1910-DYNA3.5 111.76,33.02 v112.39,33.66
GATE-EE  (via drill 0.38)
  Top 0.305: v83.19,24.13 83.19,26.67 83.82,27.3 85.02,27.3 FET_PWREE.4
  Bottom 0.305: LT1910-EE.5 82.36,23.3 v83.19,24.13
GATE-J2  (via drill 0.38)
  Top 0.305: FET_PWRJ2.4 34.33,15.28 34.92,15.88 v34.92,18.16 | v42.55,19.05 LT1910-J2.5
  Bottom 0.305: v34.92,18.16 35.62,18.86 38.35,18.86 38.54,19.05 v42.55,19.05
GATE-MAIN  (via drill 0.38)
  Top 0.305: LT1910-MAIN.5 v29.84,28.13 | v35.56,21.21 35.56,22.22 FET_PWRMAIN.4
  Bottom 0.305: v29.84,28.13 29.84,26.03 31.75,24.13 34.92,24.13 35.56,23.49 v35.56,21.21
GATE-SOL  (via drill 0.38)
  Top 0.305: v88.27,16.51 88.27,19.05 88.9,19.69 90.09,19.69 FET_PWRSOL.4
  Bottom 0.305: LT1910-SOL.5 87.63,15.88 v88.27,16.51
GND  (via drill 0.38, 0.9)
  Top 0.305: LED_12VU.C LED_5V.C LED_12V.C 9.28,8.5 9.27,8.51 9.27,7.37 DYNA1.GND | LT1910CAP-DYNA2.1 v113.67,42.55 | LT1910CAP-DYNA3.1 v113.67,31.75 | LT1910CAP-EE.1 v84.45,22.23 | LT1910CAP-SOL.1 v89.53,14.61 | MAX232_1.15 v23.5,53.34 | v90.68,28.64 90.68,30.35 90.61,30.42 90.03,30.42 U$5.6 | U$2.10 70.26,36.61 v70.48,36.83 | LT1910-J2.1 45.94,15.24 LT1910CAP-J2.1 45.72,15.03 45.72,15.24 v44.45,15.24
  Top 0.406: v65.41,11.43 LED_5V1.C | LT1910-MAIN.1 25.55,22.65 LT1910CAP-MAIN.1 25.61,22.65 26.04,22.23 v26.04,23.49
  Bottom 0.406: v26.04,23.49 26.04,24.13
  other vias: 42.55,27.94 42.55,26.8 43.81,26.8 43.81,27.94 45.09,27.94
  pour Bottom (rank 6): -8.89,57.78 -8.89,-7.62 127,-7.62 127,57.78
  pour Top: 89.79,31.43 89.79,29.46 91.44,29.46 91.44,31.43
  pour Top (no thermals): 39.69,28.45 39.69,26.54 43.31,26.54 44.45,25.4 46.35,25.4 46.35,27.3 45.21,28.45
IMEAS_12V_EE
  Top 0.305: U$5.7 88.72,31.57 92.71,35.56 92.71,48.26 94.61,50.16 103.5,50.16 U$1.PA6
IMEAS_12V_MAIN  (via drill 0.38)
  Top 0.305: U$1.PK3 40.01,50.16 32.07,50.16 29.84,47.94 29.84,45.4 24.13,39.69 v24.13,31.12 | v38.54,29.21 38.54,27.55 U$4.7
  Bottom 0.305: v38.54,29.21 38.23,29.53 29.65,29.53 29.34,29.21 25.72,29.21 24.13,30.8 v24.13,31.12
N$1  (via drill 0.38)
  Top 0.406: LED_XB_RX.A v62.87,48.26
  Bottom 0.406: v62.87,48.26 RES_LEDXBRX.2
N$1_1  (via drill 0.38)
  Top 0.305: MAX232_1.1 18.41,54.61 19.68,53.34 v19.68,52.7
  Bottom 0.305: 20.32,51.71 MAX232_C1_1.1 19.68,52.35 v19.68,52.7
N$2  (via drill 0.38)
  Top 0.406: v62.87,44.45 LED_XB_TX.A
  Bottom 0.406: RES_LEDXBTX.2 v62.87,44.45
N$2_1  (via drill 0.38)
  Top 0.305: v18.41,53.34 MAX232_1.2
  Bottom 0.305: MAX232_VPCAP_1.1 18.84,53.76 v18.41,53.34
N$3  (via drill 0.38)
  Top 0.305: v109.86,39.37 LED_DYNASWD.A
  Bottom 0.305: RES_LEDDYNASWD.1 v109.86,39.37
N$3_1  (via drill 0.38)
  Top 0.305: v17.78,52.07 MAX232_1.3
  Bottom 0.305: MAX232_C1_1.2 18.26,52.07 v17.78,52.07
N$4  (via drill 0.38)
  Top 0.305: LED_12VU.A v11.43,8.25
  Bottom 0.305: RES_LEDPWR.1 v11.43,8.25
N$4_1  (via drill 0.38)
  Top 0.305: v19.3,50.1 18.61,50.8 MAX232_1.4
  Bottom 0.305: MAX232_C2_1.1 19.27,50.16 v19.3,50.1
N$5  (via drill 0.38)
  Top 0.305: v11.43,10.16 LED_5V.A
  Bottom 0.305: RES_LEDPWR1.1 v11.43,10.16
N$5_1  (via drill 0.38)
  Top 0.305: v17.78,49.53 MAX232_1.5
  Bottom 0.305: MAX232_C2_1.2 18.2,49.53 v17.78,49.53
N$6  (via drill 0.38)
  Top 0.305: v11.43,12.07 LED_12V.A
  Bottom 0.305: RES_LEDPWR2.1 v11.43,12.07
N$6_1  (via drill 0.38)
  Top 0.305: v18.41,45.66 18.41,47.62 17.78,48.26 MAX232_1.6
  Bottom 0.406: MAX232_VNCAP_1.1 18.84,45.3 18.77,45.3 v18.41,45.66
N$7
  pour Bottom: 18.64,2 18.64,2 arc91 17.11,3.56 arc89 15.59,2.06 arc91 17.11,0.51 arc89
N$10
  pour Top (no thermals): 89.85,26.16 89.85,24.26 92.58,24.26 94.61,22.23 96.52,22.23 97.79,23.49 97.79,26.03 96.52,27.3 94.3,27.3 93.15,26.16
N$11
  Top 0.406: RES_LEDPWR3.1 65.41,7.77 LED_5V1.A
N$12
  Top 0.406: U$7.P$1 62.72,3.52 RES_LEDPWR3.2
N$13
  pour Bottom: 31.15,2 31.15,2 arc91 29.62,3.56 arc89 28.1,2.06 arc91 29.62,0.51 arc89
N$14
  pour Bottom: 41.81,2 41.81,2 arc91 40.29,3.56 arc89 38.77,2.06 arc91 40.29,0.51 arc89
N$15
  pour Bottom: 54.2,2 54.2,2 arc91 52.67,3.56 arc89 51.15,2.06 arc91 52.67,0.51 arc89
N$16
  pour Bottom: 79.6,2 79.6,2 arc91 78.07,3.56 arc89 76.55,2.06 arc91 78.07,0.51 arc89
N$17
  pour Bottom: 92.93,2 92.93,2 arc91 91.41,3.56 arc89 89.88,2.06 arc91 91.41,0.51 arc89
N$18
  pour Bottom: 106.27,2 106.27,2 arc91 104.74,3.56 arc89 103.22,2.06 arc91 104.74,0.51 arc89
N$19
  pour Bottom: 119.6,2 119.6,2 arc91 118.08,3.56 arc89 116.55,2.06 arc91 118.08,0.51 arc89
N$20
  pour Top: 119.6,2 119.6,2 arc91 118.08,3.56 arc89 116.55,2.06 arc91 118.08,0.51 arc89
N$21
  pour Bottom: 106.27,2 106.27,2 arc91 104.74,3.56 arc89 103.22,2.06 arc91 104.74,0.51 arc89
N$22
  pour Top: 106.27,2 106.27,2 arc91 104.74,3.56 arc89 103.22,2.06 arc91 104.74,0.51 arc89
N$23
  pour Bottom: 92.93,2 92.93,2 arc91 91.41,3.56 arc89 89.88,2.06 arc91 91.41,0.51 arc89
N$24
  pour Top: 92.93,2 92.93,2 arc91 91.41,3.56 arc89 89.88,2.06 arc91 91.41,0.51 arc89
N$25
  pour Bottom: 79.6,2 79.6,2 arc91 78.07,3.56 arc89 76.55,2.06 arc91 78.07,0.51 arc89
N$26
  pour Top: 79.6,2 79.6,2 arc91 78.07,3.56 arc89 76.55,2.06 arc91 78.07,0.51 arc89
N$27
  pour Bottom: 54.2,2 54.2,2 arc91 52.67,3.56 arc89 51.15,2.06 arc91 52.67,0.51 arc89
N$28
  pour Top: 54.2,2 54.2,2 arc91 52.67,3.56 arc89 51.15,2.06 arc91 52.67,0.51 arc89
N$29
  pour Bottom: 41.81,2 41.81,2 arc91 40.29,3.56 arc89 38.77,2.06 arc91 40.29,0.51 arc89
N$30
  pour Top: 41.81,2 41.81,2 arc91 40.29,3.56 arc89 38.77,2.06 arc91 40.29,0.51 arc89
N$31
  pour Bottom: 31.15,2 31.15,2 arc91 29.62,3.56 arc89 28.1,2.06 arc91 29.62,0.51 arc89
N$32
  pour Top: 31.15,2 31.15,2 arc91 29.62,3.56 arc89 28.1,2.06 arc91 29.62,0.51 arc89
N$33
  pour Bottom: 18.64,2 18.64,2 arc91 17.11,3.56 arc89 15.59,2.06 arc91 17.11,0.51 arc89
N$34
  pour Top: 18.64,2 18.64,2 arc91 17.11,3.56 arc89 15.59,2.06 arc91 17.11,0.51 arc89
N$35
  pour Top (isolate 0.406): 104.78,3.81 104.78,3.17 106.05,3.17 106.05,3.81
N$36
  pour Bottom (isolate 0.406): 104.78,3.81 104.78,3.17 106.05,3.17 106.05,3.81
R1IN
  Top 0.305: MAX232_1.13 24.77,50.8 26.67,48.89 26.67,46.99 24,44.32 19.56,44.32 16.51,41.27 16.51,36.2 13.34,33.02 13.34,12.7 17.78,8.25 22.23,8.25 25.4,5.08 41.17,5.08 J2_DATA.1
RC1_TO_J2
  Top 0.305: J2_DATA.3 37.72,7.62 50.16,7.62 50.8,8.25 50.8,9.53 51.44,10.16 53.34,10.16 U$1.PK5
RX_FROM_J2_RS232  (via drill 0.38)
  Top 0.305: U$1.PK0 v47.62,50.16 | v25.4,48.89 24.77,49.53 MAX232_1.12
  Bottom 0.305: v47.62,50.16 46.99,49.53 26.04,49.53 v25.4,48.89
RX_FROM_J2_TTL  (via drill 0.38)
  Top 0.305: U$1.PA4 38.1,50.8 31.75,50.8 29.21,48.26 29.21,45.72 25.4,41.91 20.95,41.91 19.05,40 19.05,39.31 v19.37,38.99 | v16.19,30.48 15.88,30.16 15.88,16.19 16.19,15.88 16.19,12.7 18.73,10.16 26.64,10.16 J2_DATA.5
  Bottom 0.305: v19.37,38.99 19.37,38.1 16.19,34.92 v16.19,30.48
RX_FROM_XB
  Top 0.305: U$1.PP0 53.34,53.34 53.34,51.43 54.61,50.16 62.87,50.16 62.85,50.18 62.85,50.42 LED_XB_RX.C
  Top 0.406: LED_XB_RX.C 62.87,50.8 64.14,52.07 68.07,52.07 U$2.2
SIG_DYNA1  (via drill 0.38)
  Top 0.305: v8.26,17.14 8.26,21.59 v6.35,23.49
  Bottom 0.305: U$1.PK7 13.97,11.43 v8.26,17.14 | v6.35,23.49 LT1910-DYNA1.4
SIG_DYNA2
  Bottom 0.305: LT1910-DYNA2.4 115.82,43.81 116.52,44.51 116.52,48.26 115.89,48.89 111.76,48.89 110.49,50.16 U$1.PE3
SIG_DYNA3
  Bottom 0.305: LT1910-DYNA3.4 115.89,33.02 116.52,33.66 116.52,37.46 116.01,37.97 108.71,37.97 106.68,40 106.68,50.8 U$1.PD7
SIG_EE  (via drill 0.38)
  Top 0.305: U$1.PL3 99.06,12.7 85.09,12.7 v82.55,15.24
  Bottom 0.305: v82.55,15.24 82.55,20.32 83.19,20.95 85.09,20.95 85.72,21.59 85.72,22.79 LT1910-EE.4
SIG_J2  (via drill 0.38)
  Top 0.305: U$1.PP4 40.64,53.34 31.75,53.34 27.94,49.53 27.94,46.35 24.77,43.18 20.32,43.18 17.78,40.64 17.78,35.56 14.61,32.38 14.61,15.24 v14.73,15.11 | LT1910-J2.4 47.62,19.05 48.26,18.41 v48.26,14.61
  Bottom 0.305: v48.26,14.61 46.35,12.7 36.2,12.7 35.56,12.07 17.78,12.07 v14.73,15.11
SIG_MAIN  (via drill 0.38)
  Top 0.305: U$1.PK2 41.91,49.53 32.38,49.53 30.48,47.62 30.48,45.09 26.99,41.59 v26.99,41.27 | LT1910-MAIN.4 v29.84,21.34 | v23.37,32.07 23.37,40.2 v24.13,40.96
  Bottom 0.305: v29.84,21.34 29.84,24.13 23.37,30.61 v23.37,32.07 | v24.13,40.96 26.67,40.96 v26.99,41.27
SIG_SOL  (via drill 0.38)
  Top 0.305: U$1.PL2 100.97,13.34 92.08,13.34 v90.81,14.61
  Bottom 0.305: v90.81,14.61 90.81,15.3 LT1910-SOL.4
SOURCE-DYNA1
  pour Bottom (no thermals): 3.68,9.91 3.68,7.75 4.45,6.99 4.45,5.46 4.83,5.08 5.33,5.08 5.71,5.46 5.71,6.99 6.48,7.75 6.48,9.91
SOURCE-DYNA2
  pour Top (no thermals): 113.28,46.48 113.28,43.62 115.19,43.62 115.19,46.48
  pour Top (no thermals): 113.35,43.62 115.19,43.62 116.01,44.45 118.11,44.45 118.75,44.45 118.75,45.72 116.01,45.72 115.25,46.48 113.28,46.48 113.28,43.62
SOURCE-DYNA3
  pour Top (no thermals): 113.28,35.69 113.28,32.83 115.25,32.83 115.25,35.69
  pour Top (no thermals): 115.25,32.83 116.08,33.66 118.75,33.66 118.75,34.92 116.01,34.92 115.25,35.69 113.28,35.69 113.28,32.83
SOURCE-EE
  pour Top (no thermals): 84.07,26.16 84.07,23.3 86.04,23.3 86.04,26.16
  pour Top (no thermals): 84.14,26.16 84.14,23.3 86.04,23.3 87.19,24.19 87.25,24.26 88.9,24.26 88.9,26.16
SOURCE-J2
  pour Top (no thermals): 26.67,19.69 33.97,19.69 34.04,17.84 34.1,15.11 34.1,15.05 33.66,14.61 26.67,14.61 25.4,15.88 25.4,18.41
SOURCE-MAIN
  pour Top (no thermals): 34.35,24.77 32.96,23.37 31.56,23.37 31.56,21.27 31.62,21.34 38.73,21.34 38.8,21.4 38.8,24.77
SOURCE-SOL
  pour Top (no thermals): 89.15,18.54 89.15,15.68 91.12,15.68 91.12,18.54
  pour Top (no thermals): 91.12,18.54 93.28,18.54 94.17,19.43 96.77,19.43 97.79,18.41 97.79,15.88 96.77,14.86 96.52,14.61 94.61,14.61 93.98,14.61 92.9,15.68 91.12,15.68 91.06,15.62 89.15,15.62 89.15,18.54
T1OUT  (via drill 0.38)
  Top 0.305: MAX232_1.14 24.77,52.07 27.3,49.53 27.3,46.67 24.45,43.81 20,43.81 17.14,40.96 17.14,35.88 13.97,32.7 13.97,13.02 18.1,8.89 23.05,8.89 v25.59,6.35
  Bottom 0.305: v25.59,6.35 26.86,5.08 38.18,5.08 J2_DATA.2
TX_TO_DYNA  (via drill 0.38)
  Top 0.305: v120.02,38.18 120.02,33.66 DYNA3.DATA 114.3,28.02 114.3,8.25 v111.76,5.71 | LED_DYNASWD.C 112,39.61 113.03,40.64 116.12,40.64 DYNA2.DATA 118.19,42.62 120.02,44.45 120.02,50.8 119.38,51.43 119.38,53.34 U$1.PC4 U$1.PC5
  Bottom 0.305: DYNA3.DATA 118.03,31.75 | v120.02,38.18 120.02,40.72 DYNA2.DATA | DYNA1.DATA 2.62,5.63 4.45,3.81 14.61,3.81 15.24,4.45 18.41,4.45 19.68,3.17 26.67,3.17 27.94,4.45 31.11,4.45 33.02,2.54 37.47,2.54 39.37,4.45 60.96,4.45 61.59,5.08 69.22,5.08 69.85,4.45 110.49,4.45 v111.76,5.71
TX_TO_J2_RS232  (via drill 0.38)
  Top 0.305: U$1.PK1 v45.72,50.8 | v23.5,48.26 MAX232_1.11
  Bottom 0.305: v45.72,50.8 45.09,50.16 25.4,50.16 v23.5,48.26
TX_TO_J2_TTL  (via drill 0.38)
  Top 0.305: U$1.PA5 31.75,52.07 28.57,48.89 28.57,46.04 25.08,42.55 20.64,42.55 18.41,40.32 18.41,38.48 v18.54,38.35 | v15.37,31.94 15.24,31.81 15.24,15.81 15.56,15.49 15.56,12.38 18.41,9.53 24.28,9.53 J2_DATA.6
  Bottom 0.305: v18.54,38.35 15.56,35.24 15.56,32.13 v15.37,31.94
TX_TO_XB
  Top 0.305: U$1.PP1 50.8,53.34 50.8,50.8 52.07,49.53 60.96,49.53 61.59,48.89 61.59,47.87 LED_XB_TX.C
  Top 0.406: LED_XB_TX.C 63.11,46.6 64.77,48.26 64.77,49.77 U$2.3
XB_CTS  (via drill 0.38)
  Top 0.305: U$2.12 90.68,38.61 v90.81,38.73 | v95.25,43.18 100.97,43.18 109.22,51.43 109.22,53.34 U$1.PE5
  Bottom 0.305: v90.81,38.73 v95.25,43.18
XB_DIO0
  Top 0.305: U$2.20 U$1.PB3
XB_DIO1
  Top 0.305: U$2.19 98.33,52.61 99.06,53.34 101.6,53.34 U$1.PB2
XB_DIO2
  Top 0.305: U$2.18 93.79,50.61 94.61,51.43 99.69,51.43 U$1.PM5
XB_DIO3  (via drill 0.38)
  Top 0.305: U$2.17 89.25,48.61 v88.9,48.26
  Bottom 0.305: v88.9,48.26 99.06,48.26 U$1.PM4
XB_DIO4  (via drill 0.38)
  Top 0.305: U$2.11 89.12,36.61 v88.9,36.83 | v95.25,41.91 100.97,41.91 109.22,50.16 110.49,50.16 111.76,51.43 111.76,53.34 U$1.PC6
  Bottom 0.305: v88.9,36.83 90.17,36.83 v95.25,41.91
XB_DIO5  (via drill 0.38)
  Top 0.305: U$2.15 89.06,44.61 v88.9,44.45 | v93.98,44.45 100.33,44.45 106.68,50.8 106.68,53.34 U$1.PD3
  Bottom 0.305: v88.9,44.45 v93.98,44.45
XB_DTR  (via drill 0.38)
  Top 0.305: U$2.9 62.99,38.61 53.98,47.62 51.44,47.62 v49.53,49.53
  Bottom 0.305: v49.53,49.53 49.53,50.16 48.26,51.43 48.26,53.34 U$1.PD4
XB_PWM0  (via drill 0.38)
  Top 0.305: U$2.6 68.61,43.2 66.67,41.27 64.14,41.27 63.5,41.91 60.96,41.91 54.61,48.26 52.07,48.26 v50.8,49.53
  Bottom 0.305: v50.8,49.53 50.8,50.8 U$1.PB5
XB_PWM1  (via drill 0.38)
  Top 0.305: U$2.7 64.2,42.61 64.14,42.55 61.59,42.55 v55.88,48.26
  Bottom 0.305: v55.88,48.26 54.61,49.53 U$1.PB4
XB_RESET  (via drill 0.38)
  Top 0.305: U$2.5 65.61,46.55 64.14,45.09 64.14,43.81 63.5,43.18 62.23,43.18 v57.15,48.26 | v55.88,51.05 55.88,53.34 U$1.PD2
  Bottom 0.305: v57.15,48.26 55.88,49.53 v55.88,51.05
XB_RTS  (via drill 0.38)
  Top 0.305: U$2.16 90.55,46.61 v90.81,46.35
  Bottom 0.305: v90.81,46.35 100.33,46.35 104.14,50.16 104.14,53.34 U$1.PC7

### Text on the board
tPlace: CUT ALONG DOTTED LINE | Mars Rover Design Team / Robotic Arm Rev 2 / Mike Miles | 2016 | 12V / 5V / 12VU